# Altium schematic sheet PIO.SchDoc: Laser PCB
size A3; DrawnBy: James Singleton; Organization: TMC Technology Ltd.; DocumentNumber: 7; Revision: A; SheetNumber: 7; SheetTotal: 18; Drawn Date: 22/12/2020
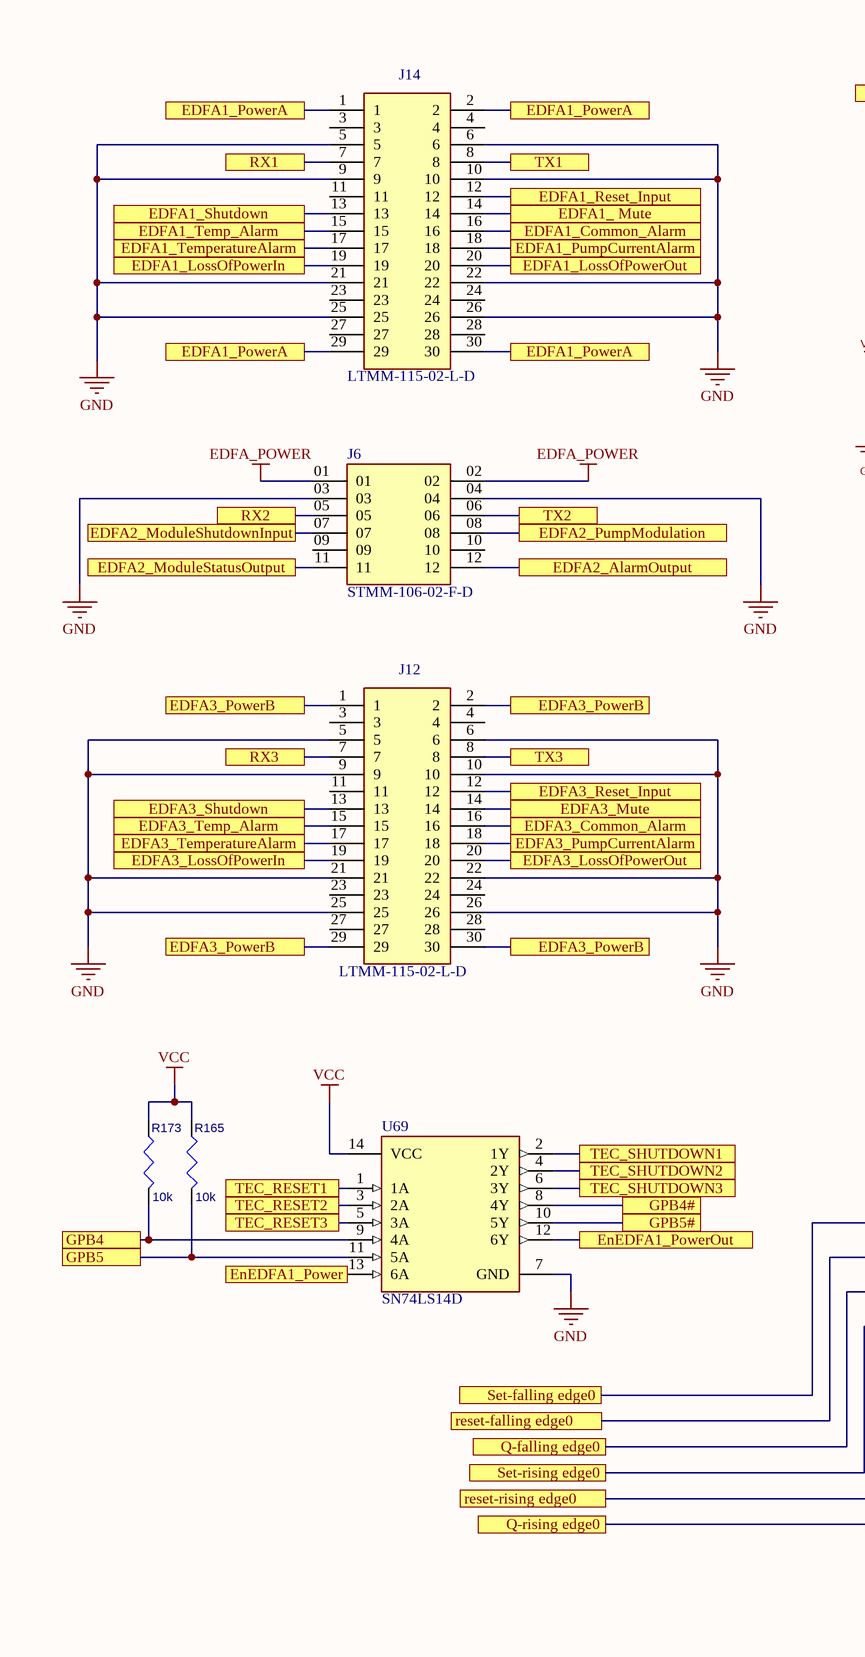
[diagram p0: PIO.SchDoc, left]
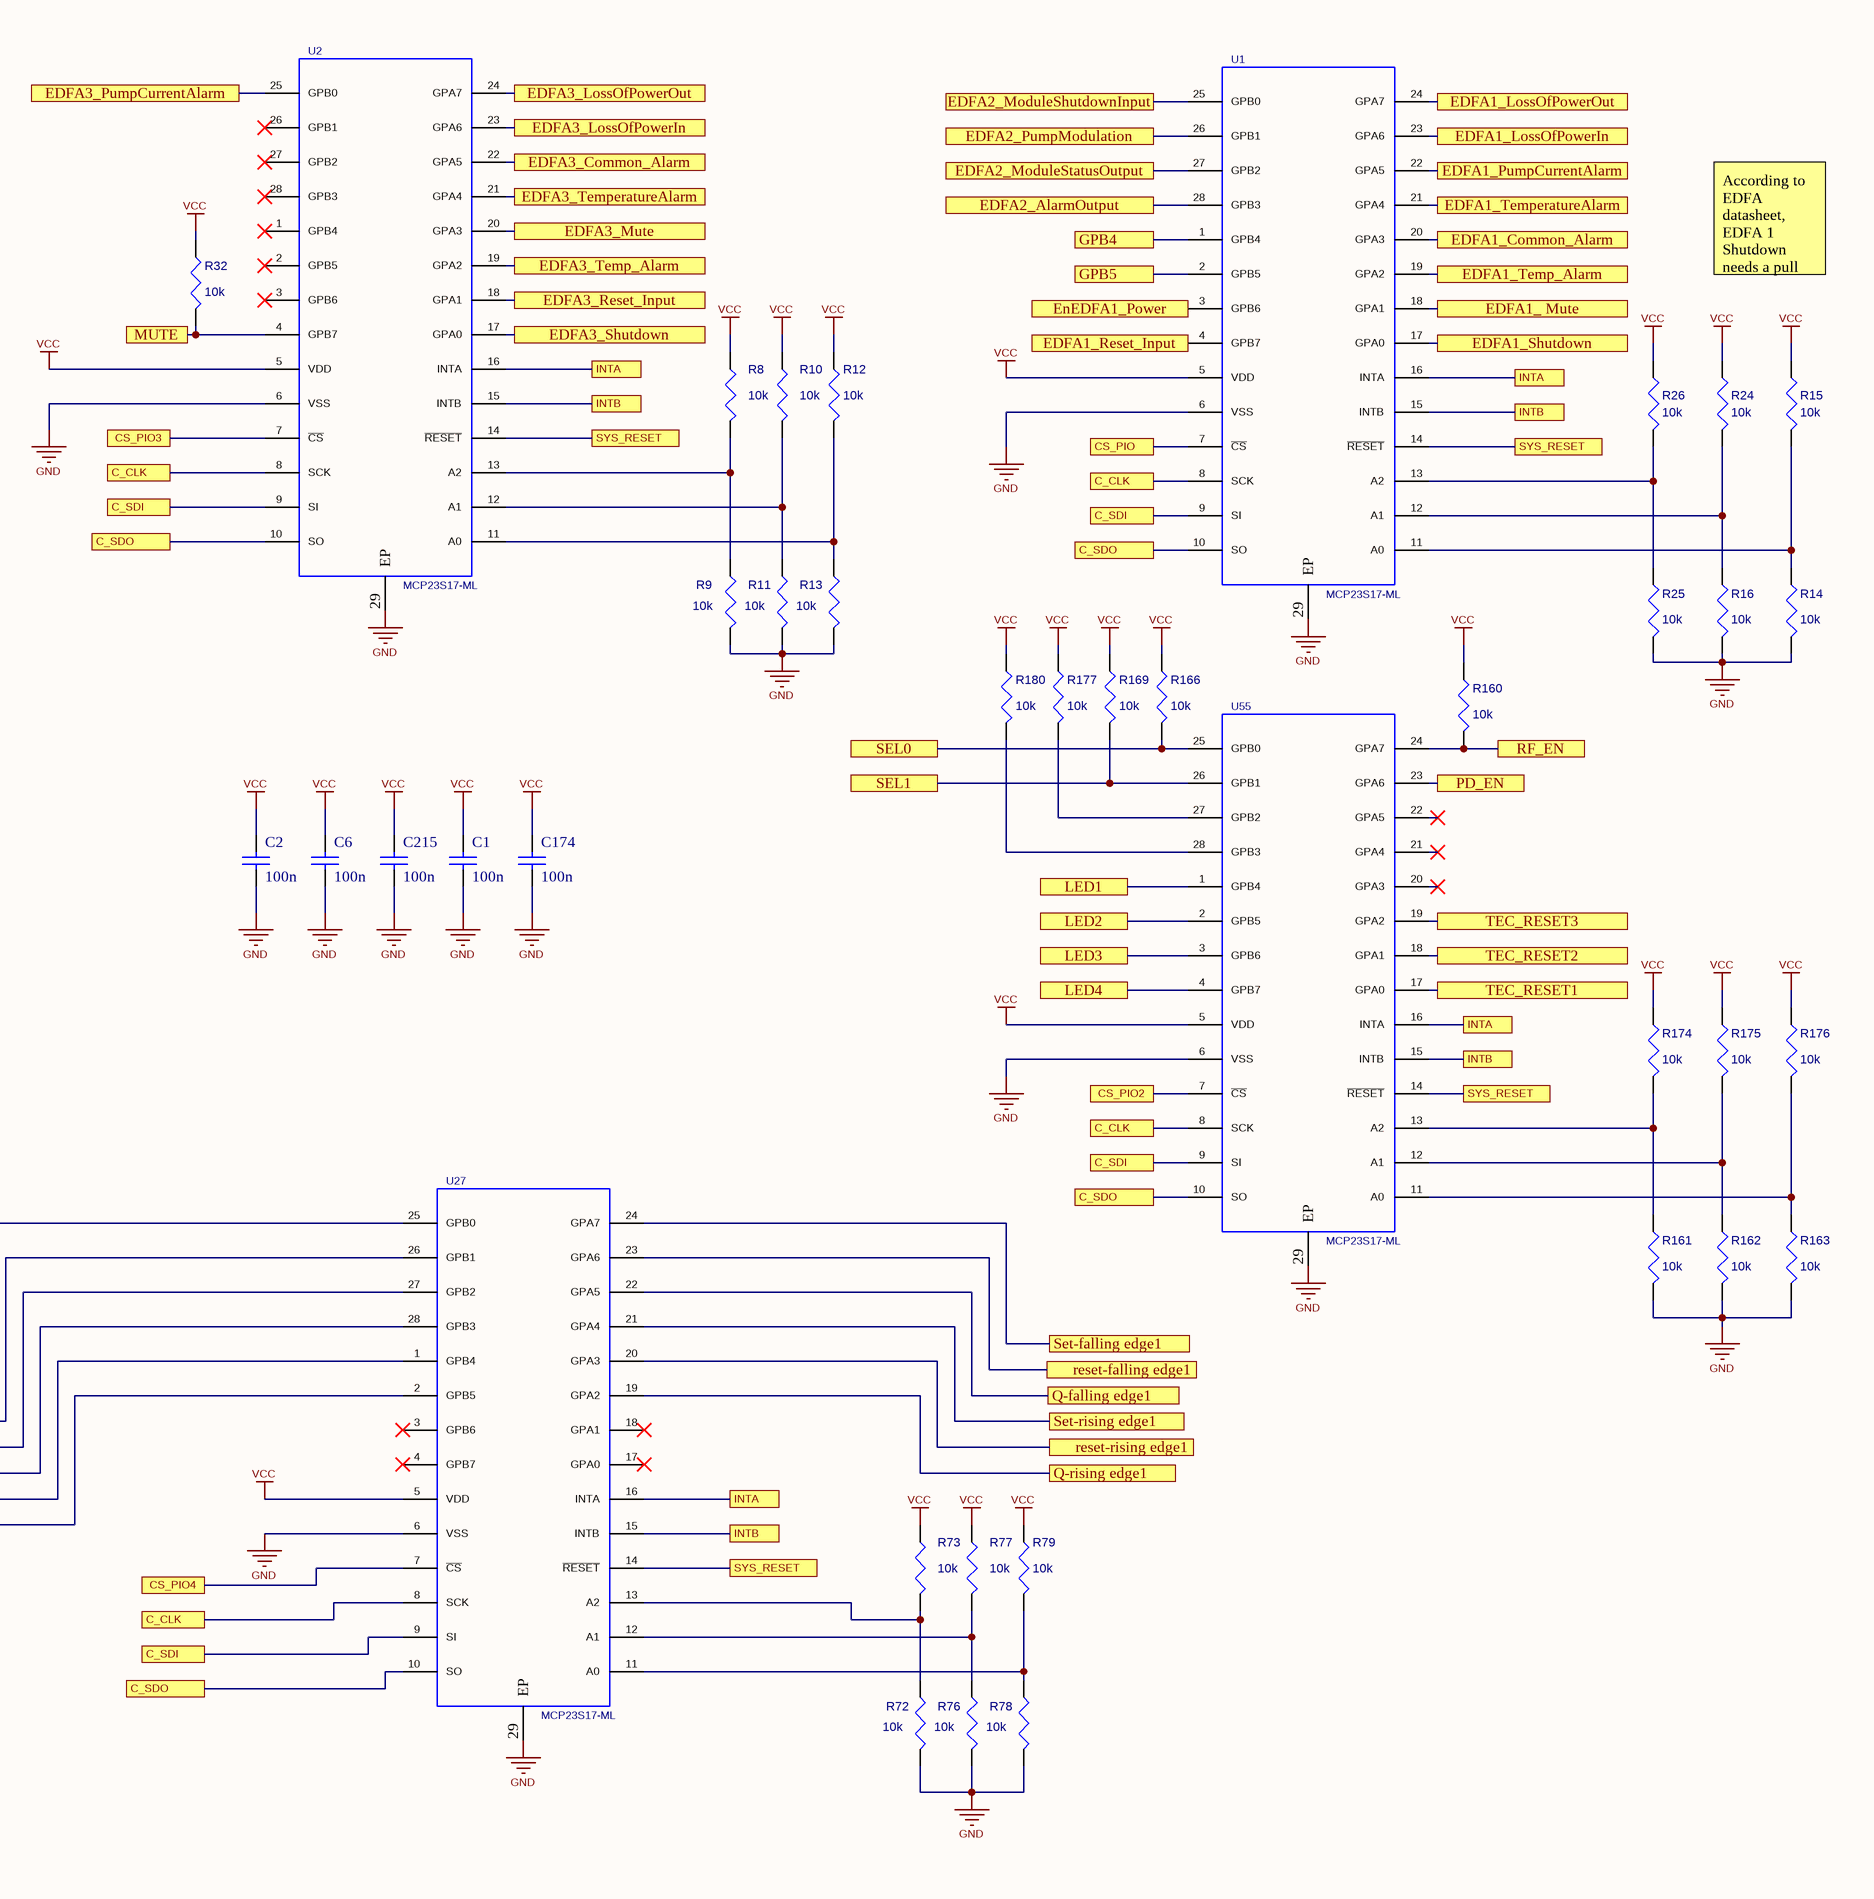
[diagram p1: PIO.SchDoc, right]

## Parts
C1  100n  [CAPC1608X90X35LL15T15]
C2  100n  [CAPC1608X90X35LL15T15]
C6  100n  [CAPC1608X90X35LL15T15]
C174  100n  [CAPC1608X90X35LL15T15]
C215  100n  [CAPC1608X90X35LL15T15]
J6  STMM-106-02-F-D  [SAMTEC_STMM-106-02-F-D]
J12  LTMM-115-02-L-D  [SHDR30W51P200_2X15_3239X651X480P]
J14  LTMM-115-02-L-D  [SHDR30W51P200_2X15_3239X651X480P]
R8  value 10k  [CR0603N]  (hidden comment: RES)
R9  value 10k  [CR0603N]  (hidden comment: RES)
R10  value 10k  [CR0603N]  (hidden comment: RES)
R11  value 10k  [CR0603N]  (hidden comment: RES)
R12  value 10k  [CR0603N]  (hidden comment: RES)
R13  value 10k  [CR0603N]  (hidden comment: RES)
R14  value 10k  [CR0603N]  (hidden comment: RES)
R15  value 10k  [CR0603N]  (hidden comment: RES)
R16  value 10k  [CR0603N]  (hidden comment: RES)
R24  value 10k  [CR0603N]  (hidden comment: RES)
R25  value 10k  [CR0603N]  (hidden comment: RES)
R26  value 10k  [CR0603N]  (hidden comment: RES)
R32  value 10k  [CR0603N]  (hidden comment: RES)
R72  value 10k  [CR0603N]  (hidden comment: RES)
R73  value 10k  [CR0603N]  (hidden comment: RES)
R76  value 10k  [CR0603N]  (hidden comment: RES)
R77  value 10k  [CR0603N]  (hidden comment: RES)
R78  value 10k  [CR0603N]  (hidden comment: RES)
R79  value 10k  [CR0603N]  (hidden comment: RES)
R160  value 10k  [CR0603N]  (hidden comment: RES)
R161  value 10k  [CR0603N]  (hidden comment: RES)
R162  value 10k  [CR0603N]  (hidden comment: RES)
R163  value 10k  [CR0603N]  (hidden comment: RES)
R165  value 10k  [CR0603N]  (hidden comment: RES)
R166  value 10k  [CR0603N]  (hidden comment: RES)
R169  value 10k  [CR0603N]  (hidden comment: RES)
R173  value 10k  [CR0603N]  (hidden comment: RES)
R174  value 10k  [CR0603N]  (hidden comment: RES)
R175  value 10k  [CR0603N]  (hidden comment: RES)
R176  value 10k  [CR0603N]  (hidden comment: RES)
R177  value 10k  [CR0603N]  (hidden comment: RES)
R180  value 10k  [CR0603N]  (hidden comment: RES)
U1  MCP23S17-ML  [QFN65P600X600X100-29VN]
U2  MCP23S17-ML  [QFN65P600X600X100-29VN]
U27  MCP23S17-ML  [QFN65P600X600X100-29VN]
U55  MCP23S17-ML  [QFN65P600X600X100-29VN]
U69  SN74LS14D  [FP-D0014A-MFG]

## Ports
C_CLK (see ChipSelects+Faults[4A], ChipSelects+Faults[4B], ChipSelects+Faults[4C], ChipSelects+Faults[4D], LIM+LEDS+POWER[8A], PI_INTERFACE[1B], PI_INTERFACE[4C], PIO[3B], PIO[3D], PIO[6B]), C_CLK (see ChipSelects+Faults[4A], ChipSelects+Faults[4B], ChipSelects+Faults[4C], ChipSelects+Faults[4D], LIM+LEDS+POWER[8A], PI_INTERFACE[1B], PI_INTERFACE[4C], PIO[3B], PIO[3D], PIO[6C]), C_CLK (see ChipSelects+Faults[4A], ChipSelects+Faults[4B], ChipSelects+Faults[4C], ChipSelects+Faults[4D], LIM+LEDS+POWER[8A], PI_INTERFACE[1B], PI_INTERFACE[4C], PIO[3B], PIO[6B], PIO[6C]), C_CLK (see ChipSelects+Faults[4A], ChipSelects+Faults[4B], ChipSelects+Faults[4C], ChipSelects+Faults[4D], LIM+LEDS+POWER[8A], PI_INTERFACE[1B], PI_INTERFACE[4C], PIO[3D], PIO[6B], PIO[6C]), C_SDI (see ChipSelects+Faults[4D], LIM+LEDS+POWER[8A], PI_INTERFACE[1B], PI_INTERFACE[4C], PIO[3B], PIO[3D], PIO[6B]), C_SDI (see ChipSelects+Faults[4D], LIM+LEDS+POWER[8A], PI_INTERFACE[1B], PI_INTERFACE[4C], PIO[3B], PIO[3D], PIO[6C]), C_SDI (see ChipSelects+Faults[4D], LIM+LEDS+POWER[8A], PI_INTERFACE[1B], PI_INTERFACE[4C], PIO[3B], PIO[6B], PIO[6C]), C_SDI (see ChipSelects+Faults[4D], LIM+LEDS+POWER[8A], PI_INTERFACE[1B], PI_INTERFACE[4C], PIO[3D], PIO[6B], PIO[6C]), C_SDO (see LIM+LEDS+POWER[6A], PI_INTERFACE[2B], PI_INTERFACE[4C], PIO[3B], PIO[3D], PIO[6B]), C_SDO (see LIM+LEDS+POWER[6A], PI_INTERFACE[2B], PI_INTERFACE[4C], PIO[3B], PIO[3D], PIO[6C]), C_SDO (see LIM+LEDS+POWER[6A], PI_INTERFACE[2B], PI_INTERFACE[4C], PIO[3B], PIO[6B], PIO[6C]), C_SDO (see LIM+LEDS+POWER[6A], PI_INTERFACE[2B], PI_INTERFACE[4C], PIO[3D], PIO[6B], PIO[6C]), CS_PIO2 (see ChipSelects+Faults[6C]), CS_PIO3 (see ChipSelects+Faults[6C]), CS_PIO4 (see PI_INTERFACE[3B], PI_INTERFACE[6A]), CS_PIO (see ChipSelects+Faults[6C]), EDFA1_ Mute (see PIO[2A]), EDFA1_ Mute (see PIO[7A]), EDFA1_Common_Alarm (see PIO[2A]), EDFA1_Common_Alarm (see PIO[7A]), EDFA1_LossOfPowerIn (see PIO[1A]), EDFA1_LossOfPowerIn (see PIO[7A]), EDFA1_LossOfPowerOut (see PIO[2A]), EDFA1_LossOfPowerOut (see PIO[7A]), EDFA1_PowerA (see Fan & Power Out[4D], PIO[1A], PIO[2A]), EDFA1_PumpCurrentAlarm (see PIO[2A]), EDFA1_PumpCurrentAlarm (see PIO[7A]), EDFA1_Reset_Input (see PIO[2A]), EDFA1_Reset_Input (see PIO[6A]), EDFA1_Shutdown (see PIO[1A]), EDFA1_Shutdown (see PIO[7A]), EDFA1_Temp_Alarm (see PIO[1A]), EDFA1_Temp_Alarm (see PIO[7A]), EDFA1_TemperatureAlarm (see PIO[1A]), EDFA1_TemperatureAlarm (see PIO[7A]), EDFA2_AlarmOutput (see PIO[2B]), EDFA2_AlarmOutput (see PIO[6A]), EDFA2_ModuleShutdownInput (see PIO[1B]), EDFA2_ModuleShutdownInput (see PIO[6A]), EDFA2_ModuleStatusOutput (see PIO[1B]), EDFA2_ModuleStatusOutput (see PIO[6A]), EDFA2_PumpModulation (see PIO[2B]), EDFA2_PumpModulation (see PIO[6A]), EDFA3_Common_Alarm (see PIO[2B]), EDFA3_Common_Alarm (see PIO[4A]), EDFA3_LossOfPowerIn (see PIO[1B]), EDFA3_LossOfPowerIn (see PIO[4A]), EDFA3_LossOfPowerOut (see PIO[2B]), EDFA3_LossOfPowerOut (see PIO[4A]), EDFA3_Mute (see PIO[2B]), EDFA3_Mute (see PIO[4A]), EDFA3_PowerB (see Fan & Power Out[6D], PIO[1B], PIO[1C], PIO[2B]), EDFA3_PowerB (see Fan & Power Out[6D], PIO[1B], PIO[1C], PIO[2C]), EDFA3_PowerB (see Fan & Power Out[6D], PIO[1B], PIO[2B], PIO[2C]), EDFA3_PowerB (see Fan & Power Out[6D], PIO[1C], PIO[2B], PIO[2C]), EDFA3_PumpCurrentAlarm (see PIO[2B]), EDFA3_PumpCurrentAlarm (see PIO[3A]), EDFA3_Reset_Input (see PIO[2B]), EDFA3_Reset_Input (see PIO[4A]), EDFA3_Shutdown (see PIO[1B]), EDFA3_Shutdown (see PIO[4A]), EDFA3_Temp_Alarm (see PIO[1B]), EDFA3_Temp_Alarm (see PIO[4A]), EDFA3_TemperatureAlarm (see PIO[1B]), EDFA3_TemperatureAlarm (see PIO[4A]), EnEDFA1_Power (see PIO[1C]), EnEDFA1_Power (see PIO[6A]), EnEDFA1_PowerOut (see Fan & Power Out[3D]), GPB4 (see PIO[1C]), GPB4 (see PIO[6A]), GPB4# (see Fan & Power Out[1C]), GPB5 (see PIO[1C]), GPB5 (see PIO[6A]), GPB5# (see Fan & Power Out[5D]), INTA (see PI_INTERFACE[5A], PIO[5A], PIO[5D], PIO[7A]), INTA (see PI_INTERFACE[5A], PIO[5A], PIO[5D], PIO[7C]), INTA (see PI_INTERFACE[5A], PIO[5A], PIO[7A], PIO[7C]), INTA (see PI_INTERFACE[5A], PIO[5D], PIO[7A], PIO[7C]), INTB (see PI_INTERFACE[5B], PIO[5A], PIO[5D], PIO[7A]), INTB (see PI_INTERFACE[5B], PIO[5A], PIO[5D], PIO[7C]), INTB (see PI_INTERFACE[5B], PIO[5A], PIO[7A], PIO[7C]), INTB (see PI_INTERFACE[5B], PIO[5D], PIO[7A], PIO[7C]), LED1 (see LIM+LEDS+POWER[7C]), LED2 (see LIM+LEDS+POWER[7C]), LED3 (see LIM+LEDS+POWER[7D]), LED4 (see LIM+LEDS+POWER[7D]), MUTE (see LIM+LEDS+POWER[6A]), PD_EN (see Fan & Power Out[4B]), Q-falling edge0 (see PIC closed loop[5A]), Q-falling edge1 (see PIC closed loop[5C]), Q-rising edge0 (see PIC closed loop[6B]), Q-rising edge1 (see PIC closed loop[6D]), reset-falling edge0 (see PIC closed loop[5A]), reset-falling edge1 (see PIC closed loop[5C]), reset-rising edge0 (see PIC closed loop[6B]), reset-rising edge1 (see PIC closed loop[6D]), RF_EN, RX1 (see PI_INTERFACE[7B]), RX2 (see PI_INTERFACE[7B]), RX3 (see PI_INTERFACE[8A]), SEL0 (see PI_INTERFACE[2D], PI_INTERFACE[5D]), SEL1 (see PI_INTERFACE[2D], PI_INTERFACE[4D]), Set-falling edge0 (see PIC closed loop[5A]), Set-falling edge1 (see PIC closed loop[5C]), Set-rising edge0 (see PIC closed loop[6B]), Set-rising edge1 (see PIC closed loop[6D]), SYS_RESET (see iDAC1[4A], iDAC1[6A], iDAC2[4A], iDAC2[6A], PI_INTERFACE[1C], PIO[5A], PIO[5D], PIO[7B], vDAC1[4A], vDAC1[5A], vDAC2[3A], vDAC2[5A]), SYS_RESET (see iDAC1[4A], iDAC1[6A], iDAC2[4A], iDAC2[6A], PI_INTERFACE[1C], PIO[5A], PIO[5D], PIO[7C], vDAC1[4A], vDAC1[5A], vDAC2[3A], vDAC2[5A]), SYS_RESET (see iDAC1[4A], iDAC1[6A], iDAC2[4A], iDAC2[6A], PI_INTERFACE[1C], PIO[5A], PIO[7B], PIO[7C], vDAC1[4A], vDAC1[5A], vDAC2[3A], vDAC2[5A]), SYS_RESET (see iDAC1[4A], iDAC1[6A], iDAC2[4A], iDAC2[6A], PI_INTERFACE[1C], PIO[5D], PIO[7B], PIO[7C], vDAC1[4A], vDAC1[5A], vDAC2[3A], vDAC2[5A]), TEC_RESET1 (see PIO[1C]), TEC_RESET1 (see PIO[7C]), TEC_RESET2 (see PIO[1C]), TEC_RESET2 (see PIO[7C]), TEC_RESET3 (see PIO[1C]), TEC_RESET3 (see PIO[7C]), TEC_SHUTDOWN1 (see TEC_CONTROLLER_1[4B]), TEC_SHUTDOWN2 (see TEC_CONTROLLER_2[4B]), TEC_SHUTDOWN3 (see TEC_CONTROLLER_3[4B]), TX1 (see PI_INTERFACE[7B]), TX2 (see PI_INTERFACE[7C]), TX3 (see PI_INTERFACE[8A])

## Nets
EDFA_POWER: J6.01 J6.02
GND: C1.2 C2.2 C6.2 C174.2 C215.2 J6.03 J6.04 J12.5 J12.6 J12.9 J12.10 J12.21 J12.22 J12.25 J12.26 J14.5 J14.6 J14.9 J14.10 J14.21 J14.22 J14.25 J14.26 R9.2 R11.2 R13.2 R14.2 R16.2 R25.2 R72.2 R76.2 R78.2 R161.2 R162.2 R163.2 U1.6(VSS) U1.29(EP) U2.6(VSS) U2.29(EP) U27.6(VSS) U27.29(EP) U55.6(VSS) U55.29(EP) U69.7(GND)
VCC: C1.1 C2.1 C6.1 C174.1 C215.1 R8.1 R10.1 R12.1 R15.1 R24.1 R26.1 R32.1 R73.1 R77.1 R79.1 R160.1 R165.1 R166.1 R169.1 R173.1 R174.1 R175.1 R176.1 R177.1 R180.1 U1.5(VDD) U2.5(VDD) U27.5(VDD) U55.5(VDD) U69.14(VCC)
C_CLK: U1.8(SCK) U2.8(SCK) U27.8(SCK) U55.8(SCK) ; port C_CLK
C_SDI: U1.9(SI) U2.9(SI) U27.9(SI) U55.9(SI) ; port C_SDI
C_SDO: U1.10(SO) U2.10(SO) U27.10(SO) U55.10(SO) ; port C_SDO
CS_PIO: U1.7(~{CS}) ; port CS_PIO
CS_PIO2: U55.7(~{CS}) ; port CS_PIO2
CS_PIO3: U2.7(~{CS}) ; port CS_PIO3
CS_PIO4: U27.7(~{CS}) ; port CS_PIO4
EDFA1_ Mute: J14.14 U1.18(GPA1) ; port EDFA1_ Mute
EDFA1_Common_Alarm: J14.16 U1.20(GPA3) ; port EDFA1_Common_Alarm
EDFA1_LossOfPowerIn: J14.19 U1.23(GPA6) ; port EDFA1_LossOfPowerIn
EDFA1_LossOfPowerOut: J14.20 U1.24(GPA7) ; port EDFA1_LossOfPowerOut
EDFA1_PowerA: J14.1 J14.2 J14.29 J14.30 ; port EDFA1_PowerA
EDFA1_PumpCurrentAlarm: J14.18 U1.22(GPA5) ; port EDFA1_PumpCurrentAlarm
EDFA1_Reset_Input: J14.12 U1.4(GPB7) ; port EDFA1_Reset_Input
EDFA1_Shutdown: J14.13 U1.17(GPA0) ; port EDFA1_Shutdown
EDFA1_Temp_Alarm: J14.15 U1.19(GPA2) ; port EDFA1_Temp_Alarm
EDFA1_TemperatureAlarm: J14.17 U1.21(GPA4) ; port EDFA1_TemperatureAlarm
EDFA2_AlarmOutput: J6.12 U1.28(GPB3) ; port EDFA2_AlarmOutput
EDFA2_ModuleShutdownInput: J6.07 U1.25(GPB0) ; port EDFA2_ModuleShutdownInput
EDFA2_ModuleStatusOutput: J6.11 U1.27(GPB2) ; port EDFA2_ModuleStatusOutput
EDFA2_PumpModulation: J6.08 U1.26(GPB1) ; port EDFA2_PumpModulation
EDFA3_Common_Alarm: J12.16 U2.22(GPA5) ; port EDFA3_Common_Alarm
EDFA3_LossOfPowerIn: J12.19 U2.23(GPA6) ; port EDFA3_LossOfPowerIn
EDFA3_LossOfPowerOut: J12.20 U2.24(GPA7) ; port EDFA3_LossOfPowerOut
EDFA3_Mute: J12.14 U2.20(GPA3) ; port EDFA3_Mute
EDFA3_PowerB: J12.1 J12.2 J12.29 J12.30 ; port EDFA3_PowerB
EDFA3_PumpCurrentAlarm: J12.18 U2.25(GPB0) ; port EDFA3_PumpCurrentAlarm
EDFA3_Reset_Input: J12.12 U2.18(GPA1) ; port EDFA3_Reset_Input
EDFA3_Shutdown: J12.13 U2.17(GPA0) ; port EDFA3_Shutdown
EDFA3_Temp_Alarm: J12.15 U2.19(GPA2) ; port EDFA3_Temp_Alarm
EDFA3_TemperatureAlarm: J12.17 U2.21(GPA4) ; port EDFA3_TemperatureAlarm
EnEDFA1_Power: U1.3(GPB6) U69.13(6A) ; port EnEDFA1_Power
EnEDFA1_PowerOut: U69.12(6Y) ; port EnEDFA1_PowerOut
GPB4: R173.2 U1.1(GPB4) U69.9(4A) ; port GPB4
GPB4#: U69.8(4Y) ; port GPB4#
GPB5: R165.2 U1.2(GPB5) U69.11(5A) ; port GPB5
GPB5#: U69.10(5Y) ; port GPB5#
INTA: U1.16(INTA) U2.16(INTA) U27.16(INTA) U55.16(INTA) ; port INTA
INTB: U1.15(INTB) U2.15(INTB) U27.15(INTB) U55.15(INTB) ; port INTB
LED1: U55.1(GPB4) ; port LED1
LED2: U55.2(GPB5) ; port LED2
LED3: U55.3(GPB6) ; port LED3
LED4: U55.4(GPB7) ; port LED4
MUTE: R32.2 U2.4(GPB7) ; port MUTE
PD_EN: U55.23(GPA6) ; port PD_EN
Q-falling edge0: U27.27(GPB2) ; port Q-falling edge0
Q-falling edge1: U27.22(GPA5) ; port Q-falling edge1
Q-rising edge0: U27.2(GPB5) ; port Q-rising edge0
Q-rising edge1: U27.19(GPA2) ; port Q-rising edge1
reset-falling edge0: U27.26(GPB1) ; port reset-falling edge0
reset-falling edge1: U27.23(GPA6) ; port reset-falling edge1
reset-rising edge0: U27.1(GPB4) ; port reset-rising edge0
reset-rising edge1: U27.20(GPA3) ; port reset-rising edge1
RF_EN: R160.2 U55.24(GPA7) ; port RF_EN
RX1: J14.7 ; port RX1
RX2: J6.05 ; port RX2
RX3: J12.7 ; port RX3
SEL0: R166.2 U55.25(GPB0) ; port SEL0
SEL1: R169.2 U55.26(GPB1) ; port SEL1
Set-falling edge0: U27.25(GPB0) ; port Set-falling edge0
Set-falling edge1: U27.24(GPA7) ; port Set-falling edge1
Set-rising edge0: U27.28(GPB3) ; port Set-rising edge0
Set-rising edge1: U27.21(GPA4) ; port Set-rising edge1
SYS_RESET: U1.14(~{RESET}) U2.14(~{RESET}) U27.14(~{RESET}) U55.14(~{RESET}) ; port SYS_RESET
TEC_RESET1: U55.17(GPA0) U69.1(1A) ; port TEC_RESET1
TEC_RESET2: U55.18(GPA1) U69.3(2A) ; port TEC_RESET2
TEC_RESET3: U55.19(GPA2) U69.5(3A) ; port TEC_RESET3
TEC_SHUTDOWN1: U69.2(1Y) ; port TEC_SHUTDOWN1
TEC_SHUTDOWN2: U69.4(2Y) ; port TEC_SHUTDOWN2
TEC_SHUTDOWN3: U69.6(3Y) ; port TEC_SHUTDOWN3
TX1: J14.8 ; port TX1
TX2: J6.06 ; port TX2
TX3: J12.8 ; port TX3
NetR8_2: R8.2 R9.1 U2.13(A2)
NetR10_2: R10.2 R11.1 U2.12(A1)
NetR12_2: R12.2 R13.1 U2.11(A0)
NetR14_1: R14.1 R15.2 U1.11(A0)
NetR16_1: R16.1 R24.2 U1.12(A1)
NetR25_1: R25.1 R26.2 U1.13(A2)
NetR72_1: R72.1 R73.2 U27.13(A2)
NetR76_1: R76.1 R77.2 U27.12(A1)
NetR78_1: R78.1 R79.2 U27.11(A0)
NetR161_1: R161.1 R174.2 U55.13(A2)
NetR162_1: R162.1 R175.2 U55.12(A1)
NetR163_1: R163.1 R176.2 U55.11(A0)
NetR177_2: R177.2 U55.27(GPB2)
NetR180_2: R180.2 U55.28(GPB3)

Not connected (* = marked no-connect by the designer): J6 09 10; J12 3 4 11 23 24 27 28; J14 3 4 11 23 24 27 28; U2 1(GPB4)* 2(GPB5)* 3(GPB6)* 26(GPB1)* 27(GPB2)* 28(GPB3)*; U27 3(GPB6)* 4(GPB7)* 17(GPA0)* 18(GPA1)*; U55 20(GPA3)* 21(GPA4)* 22(GPA5)*

## Notes on the sheet
- According to EDFA datasheet, EDFA 1 Shutdown needs a pull up resistor
- TMC Technology Ltd.
- Page Contents:
- Project:
- Variant:
- Checked By:
- Size:
- Date:
- Dwg No:
- Sheet
- of
- Revision:

## Library data of the parts
C1 C2 C6 C174 C215 = CMP-1035-02592-3: Chip Capacitor, 100 nF, +/- 10%, 50 V, -55 to 125 degC, 0603 (1608 Metric), RoHS, Tape and Reel; Manufacturer: KEMET; Manufacturer Part Number: C0603C104K5RACTU; Case\Package: 0603; Type (Capacitors): X7R; Capacitance: 100 nF; Voltage Rating: 50 V; Pins: 2; Max Operating Temperature: 125 degC; Min Operating Temperature: -55 degC; Case Code (Imperial): 0603; DatasheetVersion: 07/2016; Package Quantity: 4000; Length: 1.6 mm; REACH SVHC: No SVHC; Packaging: Tape and Reel; Case Code (Metric): 1608; Mounting Technology: Surface Mount; RoHSCompliant: true; Height: 0.9 mm; ComponentLink1URL: http://www.avx.com/; ComponentLink2URL: http://datasheets.avx.com/X7RDielectric.pdf; Mount: Surface Mount; ComponentLink2Description: Datasheet; Width: 0.81 mm; PackageReference: 0603; PackageDescription: 2-Pin Surface Mount Device, Body 1.6 x 0.81 mm; Radiation Hardening: No; ComponentLink1Description: Manufacturer URL; Voltage Rating (DC): 50 V; Tolerance: 10%; 8Vinv: *
J6 = STMM-106-02-F-D: Connector Header Surface Mount 12 position 0.079 (2.00mm); MF: Samtec; MP: STMM-106-02-F-D; SnapEDA_Link: https://www.snapeda.com/parts/STMM-106-02-F-D/Samtec/view-part/3254548/?ref=snap; Value: *; Package: None; Price: None; Availability: Bad; Check_prices: https://www.snapeda.com/parts/STMM-106-02-F-D/Samtec/view-part/3254548/?ref=eda
J12 J14 = LTMM-115-02-L-D: Connector; Manufacturer_Name: SAMTEC; Datasheet Link: https://componentsearchengine.com/Datasheets/2/LTMM-115-02-L-D.pdf; Height: 4.8mm; Manufacturer_Part_Number: LTMM-115-02-L-D; Mouser Part Number: 200-LTMM11502LD; Mouser Price/Stock: https://www.mouser.co.uk/ProductDetail/Samtec/LTMM-115-02-L-D?qs=PB6%2FjmICvI0Cyj5H953Cwg%3D%3D
R8-R16 R24-R26 R32 R72 R73 R76-R79 R160-R163 R165 R166 R169 R173-R177 R180 = RES: RES.,10k OHMS,1%,1/10W,0603; Manufacturer_PN: ERJ3EKF1002V; Manufacturer: PANASONIC; Part No: P10.0KHCT-ND; CLASS: DISCRETE; Temperature_Coefficient: 100ppm/C; FPLIST: CR0603N,CR0603L,CR0603M; Source_Path: \\MIL-NS1\CIP\SCHEMATIC_SYMBOLS\LTC_RESISTOR.OLB; Geometry.Height: 37.40mil; PCB DECAL: CR0603N; Rated_Power: 1/10W; Tolerance: 1%; Package_Size: 0603
U1 U2 U27 U55 = MCP23S17-ML: Manufacturer: Microchip; Part No: MCP23S17-E/ML; Geometry.Height: 1mm; Order No: 3380575; PCB DECAL: QFN65P600X600X100-29VN
U69 = CMP-1615-00144-4: IC INVERTER SCHMITT 6CH 14SOIC; Manufacturer: Texas Instruments; Propagation Delay: 15ns; Number Of Circuits: 6; Number Of Inputs: 1; Max Supply Voltage: 5.25V; Logic Function Desc: Schmitt Trigger; Max Junction Temp: +150°C; Standoff Height: 0.1mm; Min Supply Voltage: 4.75V; Lead Free: Yes; Category: IC; Height: 1.75mm; Ambient Temperature Range Low: 0°C; Octopart: https://octopart.com/sn74ls14d-texas+instruments-464458; Device Class L1: Integrated Circuits (ICs); Digikey Description: IC INVERTER SCHMITT 6CH 14SOIC; Manufacturer Part Number: SN74LS14D; Ambient Temperature Range High: +70°C; Device Class L2: Logic ICs; ComponentLink2Description: Datasheet; Device Class L3: Logic Gates; Temperature Range High: +70°C; ComponentLink2URL: http://www.ti.com/lit/ds/symlink/sn74ls14.pdf; Number Of Outputs: 1; Temperature: 0°C to +70°C; RoHS: TRUE; Mouser Description: Inverters Hex Schmitt-Trigger; Temperature Range Low: 0°C; Package: D0014A; Automotive: No